# Altium schematic sheet TestBoardV1.SchDoc
size A
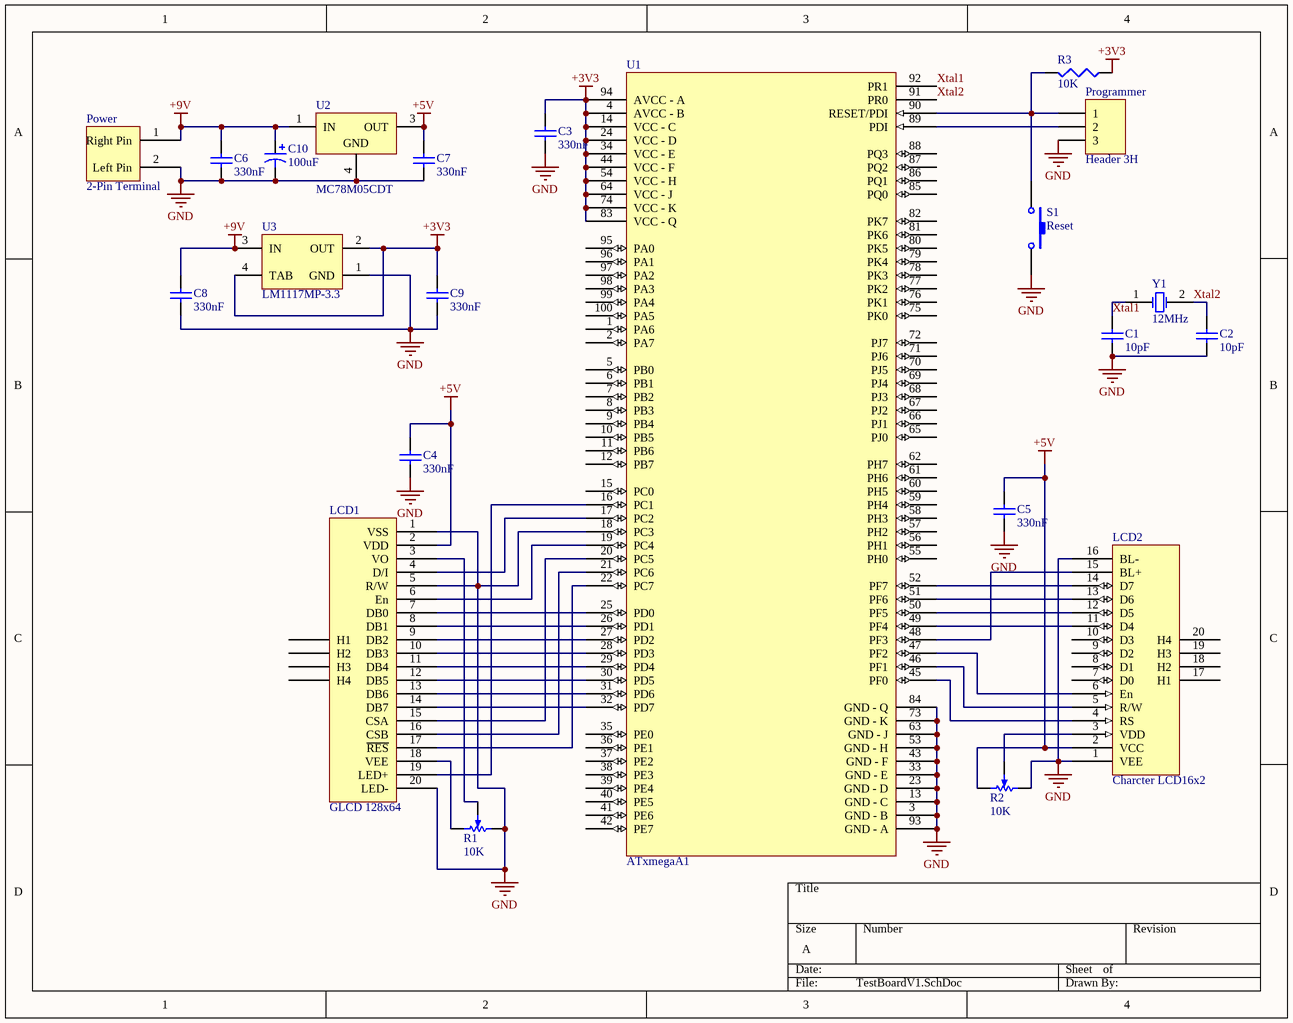
[diagram p0: TestBoardV1.SchDoc]

## Parts
C1  value 10pF  [C1206]  (hidden comment: Cap Semi)
C2  value 10pF  [C1206]  (hidden comment: Cap Semi)
C3  value 330nF  [C1206]  (hidden comment: Cap Semi)
C4  value 330nF  [C1206]  (hidden comment: Cap Semi)
C5  value 330nF  [C1206]  (hidden comment: Cap Semi)
C6  value 330nF  [C1206]  (hidden comment: Cap Semi)
C7  value 330nF  [C1206]  (hidden comment: Cap Semi)
C8  value 330nF  [C1206]  (hidden comment: Cap Semi)
C9  value 330nF  [C1206]  (hidden comment: Cap Semi)
C10  100uF  [Cap Pole-100u]
LCD1  GLCD 128x64  [GLCD 128X64]
LCD2  Charcter LCD16x2  [LCD16x2]
Power  2-Pin Terminal  [2-pin Terminal]
Programmer  Header 3H  [HDR1X3H]
R1  10K  [POT4MM-2]
R2  10K  [POT4MM-2]
R3  value 10K  [MELF-R3216-1206]  (hidden comment: Res3)
S1  Reset  [SMD_Switch]
U1  ATxmegaA1  [TQFP100]
U2  MC78M05CDT  [369A-03]
U3  LM1117MP-3.3  [MP04A_N]
Y1  12MHz  [HC-49U]

## Nets
+3V3: C3.2 C9.2 R3.1 U1.4(AVCC_-_B) U1.14(VCC_-_C) U1.24(VCC_-_D) U1.34(VCC_-_E) U1.44(VCC_-_F) U1.54(VCC_-_H) U1.64(VCC_-_J) U1.74(VCC_-_K) U1.83(VCC_-_Q) U1.94(AVCC_-_A) U3.2(OUT) U3.4(TAB)
+5V: C4.2 C5.2 C7.2 LCD1.2(VDD) LCD2.2(VCC) R2.CW(+) U2.3(OUT)
+9V: C6.2 C8.2 C10.1 Power.1(Right_Pin) U2.1(IN) U3.3(IN)
GND: C1.2 C2.1 C3.1 C4.1 C5.1 C6.1 C7.1 C8.1 C9.1 C10.2 LCD1.1(VSS) LCD1.5(R/W) LCD1.20(LED-) LCD2.1(VEE) LCD2.16(BL-) Power.2(Left_Pin) Programmer.3 R1.CCW(-) R2.CCW(-) S1.1 U1.3(GND_-_B) U1.13(GND_-_C) U1.18(PC3) U1.23(GND_-_D) U1.33(GND_-_E) U1.43(GND_-_F) U1.53(GND_-_H) U1.63(GND_-_J) U1.73(GND_-_K) U1.84(GND_-_Q) U1.93(GND_-_A) U2.4(GND) U3.1(GND)
Xtal1: C1.1 U1.92(PR1) Y1.1(OSC1)
Xtal2: C2.2 U1.91(PR0) Y1.2(OSC2)
NetLCD1_3: LCD1.3(VO) R1.W
NetLCD1_4: LCD1.4(D/I) U1.17(PC2)
NetLCD1_6: LCD1.6(En) U1.19(PC4)
NetLCD1_7: LCD1.7(DB0) U1.25(PD0)
NetLCD1_8: LCD1.8(DB1) U1.26(PD1)
NetLCD1_9: LCD1.9(DB2) U1.27(PD2)
NetLCD1_10: LCD1.10(DB3) U1.28(PD3)
NetLCD1_11: LCD1.11(DB4) U1.29(PD4)
NetLCD1_12: LCD1.12(DB5) U1.30(PD5)
NetLCD1_13: LCD1.13(DB6) U1.31(PD6)
NetLCD1_14: LCD1.14(DB7) U1.32(PD7)
NetLCD1_15: LCD1.15(CSA) U1.20(PC5)
NetLCD1_16: LCD1.16(CSB) U1.21(PC6)
NetLCD1_17: LCD1.17(~{RES}) U1.22(PC7)
NetLCD1_18: LCD1.18(VEE) R1.CW(+)
NetLCD1_19: LCD1.19(LED+) U1.16(PC1)
NetLCD2_3: LCD2.3(VDD) R2.W
NetLCD2_4: LCD2.4(RS) U1.45(PF0)
NetLCD2_5: LCD2.5(R/W) U1.46(PF1)
NetLCD2_6: LCD2.6(En) U1.47(PF2)
NetLCD2_11: LCD2.11(D4) U1.49(PF4)
NetLCD2_12: LCD2.12(D5) U1.50(PF5)
NetLCD2_13: LCD2.13(D6) U1.51(PF6)
NetLCD2_14: LCD2.14(D7) U1.52(PF7)
NetLCD2_15: LCD2.15(BL+) U1.48(PF3)
NetProgrammer_1: Programmer.1 R3.2 S1.2 U1.90(RESET/PDI)
NetProgrammer_2: Programmer.2 U1.89(PDI)

Not connected (* = marked no-connect by the designer): LCD1 21(H1) 22(H2) 23(H3) 24(H4); LCD2 7(D0) 8(D1) 9(D2) 10(D3) 17(H1) 18(H2) 19(H3) 20(H4); U1 1(PA6) 2(PA7) 5(PB0) 6(PB1) 7(PB2) 8(PB3) 9(PB4) 10(PB5) 11(PB6) 12(PB7) 15(PC0) 35(PE0) 36(PE1) 37(PE2) 38(PE3) 39(PE4) 40(PE5) 41(PE6) 42(PE7) 55(PH0) 56(PH1) 57(PH2) 58(PH3) 59(PH4) 60(PH5) 61(PH6) 62(PH7) 65(PJ0) 66(PJ1) 67(PJ2) 68(PJ3) 69(PJ4) 70(PJ5) 71(PJ6) 72(PJ7) 75(PK0) 76(PK1) 77(PK2) 78(PK3) 79(PK4) 80(PK5) 81(PK6) 82(PK7) 85(PQ0) 86(PQ1) 87(PQ2) 88(PQ3) 95(PA0) 96(PA1) 97(PA2) 98(PA3) 99(PA4) 100(PA5)

## Library data of the parts
C1-C9 = Cap Semi: Capacitor (Semiconductor SIM Model); Published: 8-Jun-2000; LatestRevisionDate: 17-Jul-2002; LatestRevisionNote: Re-released for DXP Platform.; PackageReference: C1206; Publisher: Altium Limited
C10 = Cap Pole
LCD2 = LCD16x2
Programmer = Header 3H: Header, 3-Pin, Right Angle; LatestRevisionDate: 17-Jul-2002; LatestRevisionNote: Re-released for DXP Platform.; Publisher: Altium Limited
R1 R2 = RPot SM: Square Trimming Potentiometer; Published: 17-Dec-2003; DatasheetDocument: Oct-2003; PackageReference: POT4MM-2; Publisher: Altium Limited; ComponentLink1Description: Manufacturer Link; ComponentLink1URL: http://bourns.com/2/search.html
R3 = Res3: Resistor; Published: 8-Jun-2000; LatestRevisionDate: 04-Mar-2005; LatestRevisionNote: PCB Footprint replaced.; PackageReference: J1-0603; Publisher: Altium Limited
S1 = SW-PB: Switch; Published: 24-Mar-1999; LatestRevisionDate: 17-Jul-2002; LatestRevisionNote: Re-released for DXP Platform.; PackageReference: SPST-2; Publisher: Altium Limited
U1 = ATxMega_A1: High Performance 8/16bit MCU
U2 = MC78M05CDT: 3-Terminal Medium-Current Positive Fixed Voltage Regulator; Note: Heatsink suface connected to pin 4.; Published: 17-Jul-2002; DatasheetVersion: 1988; PackageReference: 369A-03; Publisher: Altium Limited; PackageDescription: D-PAK/TO-252-AA; 3 Leads (1 Cropped); Body 10.2 (inc. leads) x 6.7 mm (LxW max); ComponentLink1Description: Manufacturer Link; ComponentLink1URL: http://www.onsemi.com/site/products/taxonomy/0,4438,503,00.html; ComponentLink2Description: Datasheet; ComponentLink2URL: http://www.onsemi.com/pub/Collateral/MC78M00-D.PDF
U3 = LM1117MP-3.3: 800mA Low-Dropout Linear Regulator; Manufacturer: National Semiconductor; CompType: LDO IC; PackageTopMarking: XYTT*N05A; PowerWise: N; Published: 4-Dec-2008; DatasheetVersion: Apr-2006; PackageVersion: revB, Apr-2003; PackageReference: MP04A; Publisher: Altium Limited; PackageDescription: Molded SOT-223, 6.50 x 3.56 x 1.6mm Body, 4 Lead, 2.3mm Pitch; PartNumber: LM1117MP-3.3; RoHS: O; PinCount: 4; DigiKeyPartNumber: LM1117MP-3.3CT-ND; Code_JEDEC: TO-261-AA; Code_IPC: SOT223-4; ComponentLink1Description: LM1117 Datasheet; ComponentLink1URL: http://www.national.com/ds/LM/LM1117.pdf; ComponentLink2Description: LM1117 Web Page; ComponentLink2URL: http://www.national.com/pf/LM/LM1117.html; ComponentLink3Description: MP04A Package Page; ComponentLink3URL: http://www.national.com/packaging/folders/mp04a.html
Y1 = ECS-10-13-1: Crystal Oscillator; Published: 17-Jul-2002; DatasheetDocument: 18-Apr-2000; PackageReference: HC-49U; Publisher: Altium Limited; ComponentLink1Description: Manufacturer Link; ComponentLink1URL: http://www.ecsxtal.com/; ComponentLink2Description: Datasheet; ComponentLink2URL: http://www.ecsxtal.com/pdf2/HC49U.PDF